# Altium schematic sheet Scheme_1.SchDoc
size A2; DrawnBy: Amrello
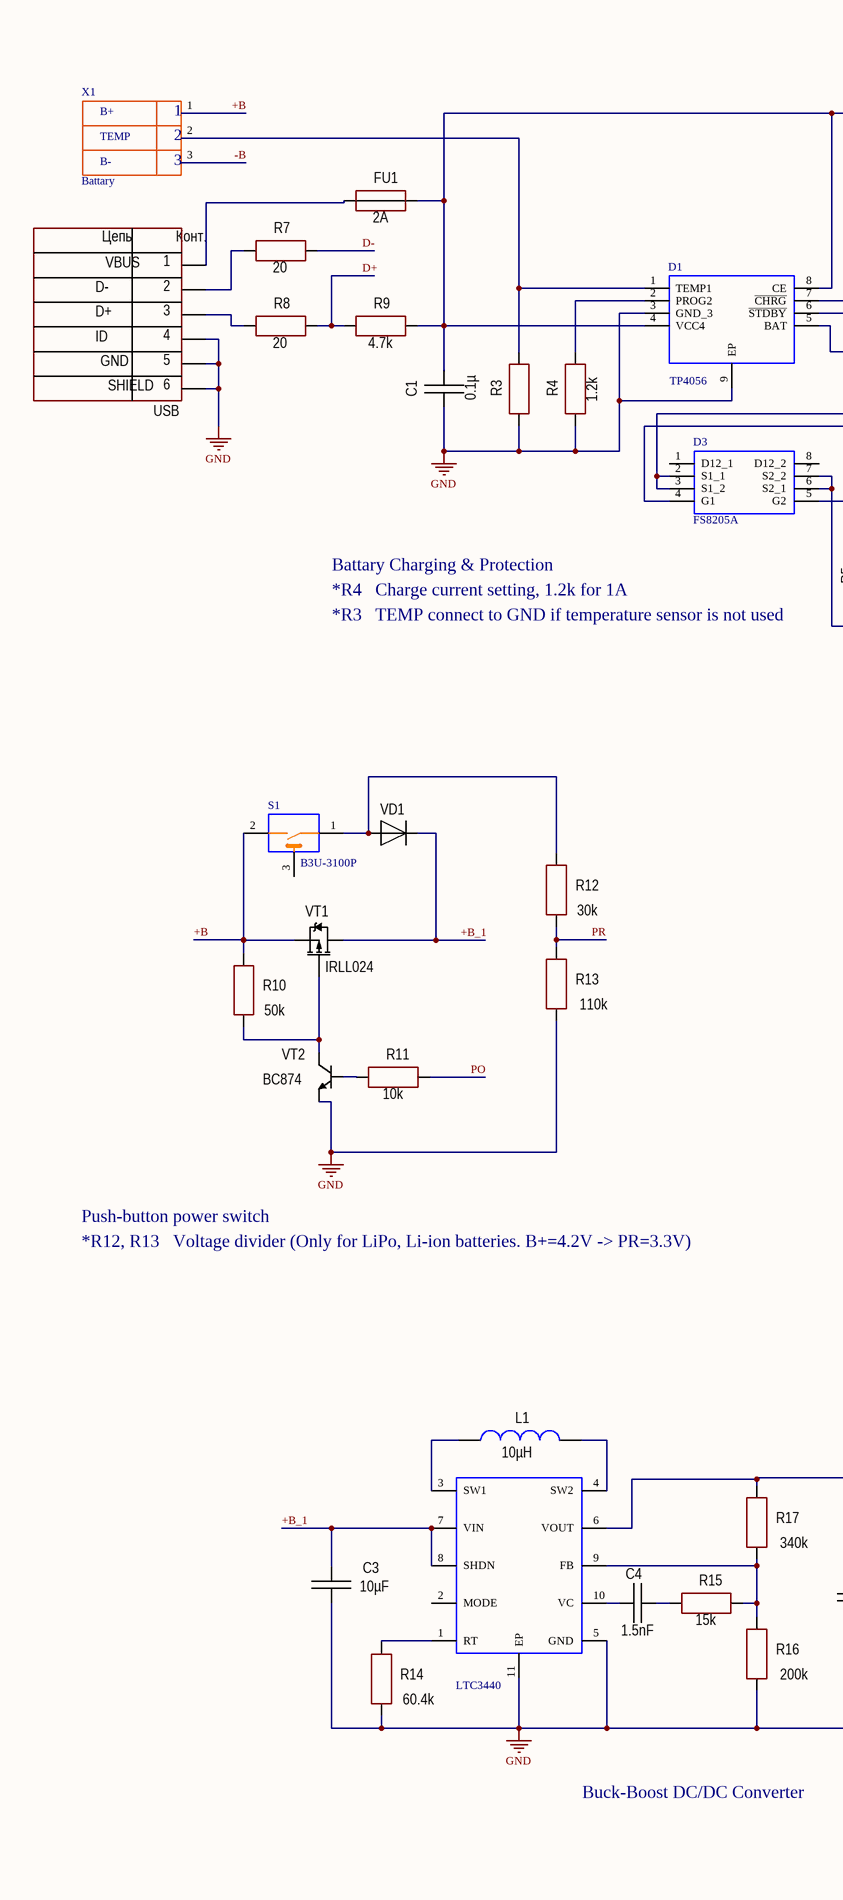
[diagram p0: Scheme_1.SchDoc, left]
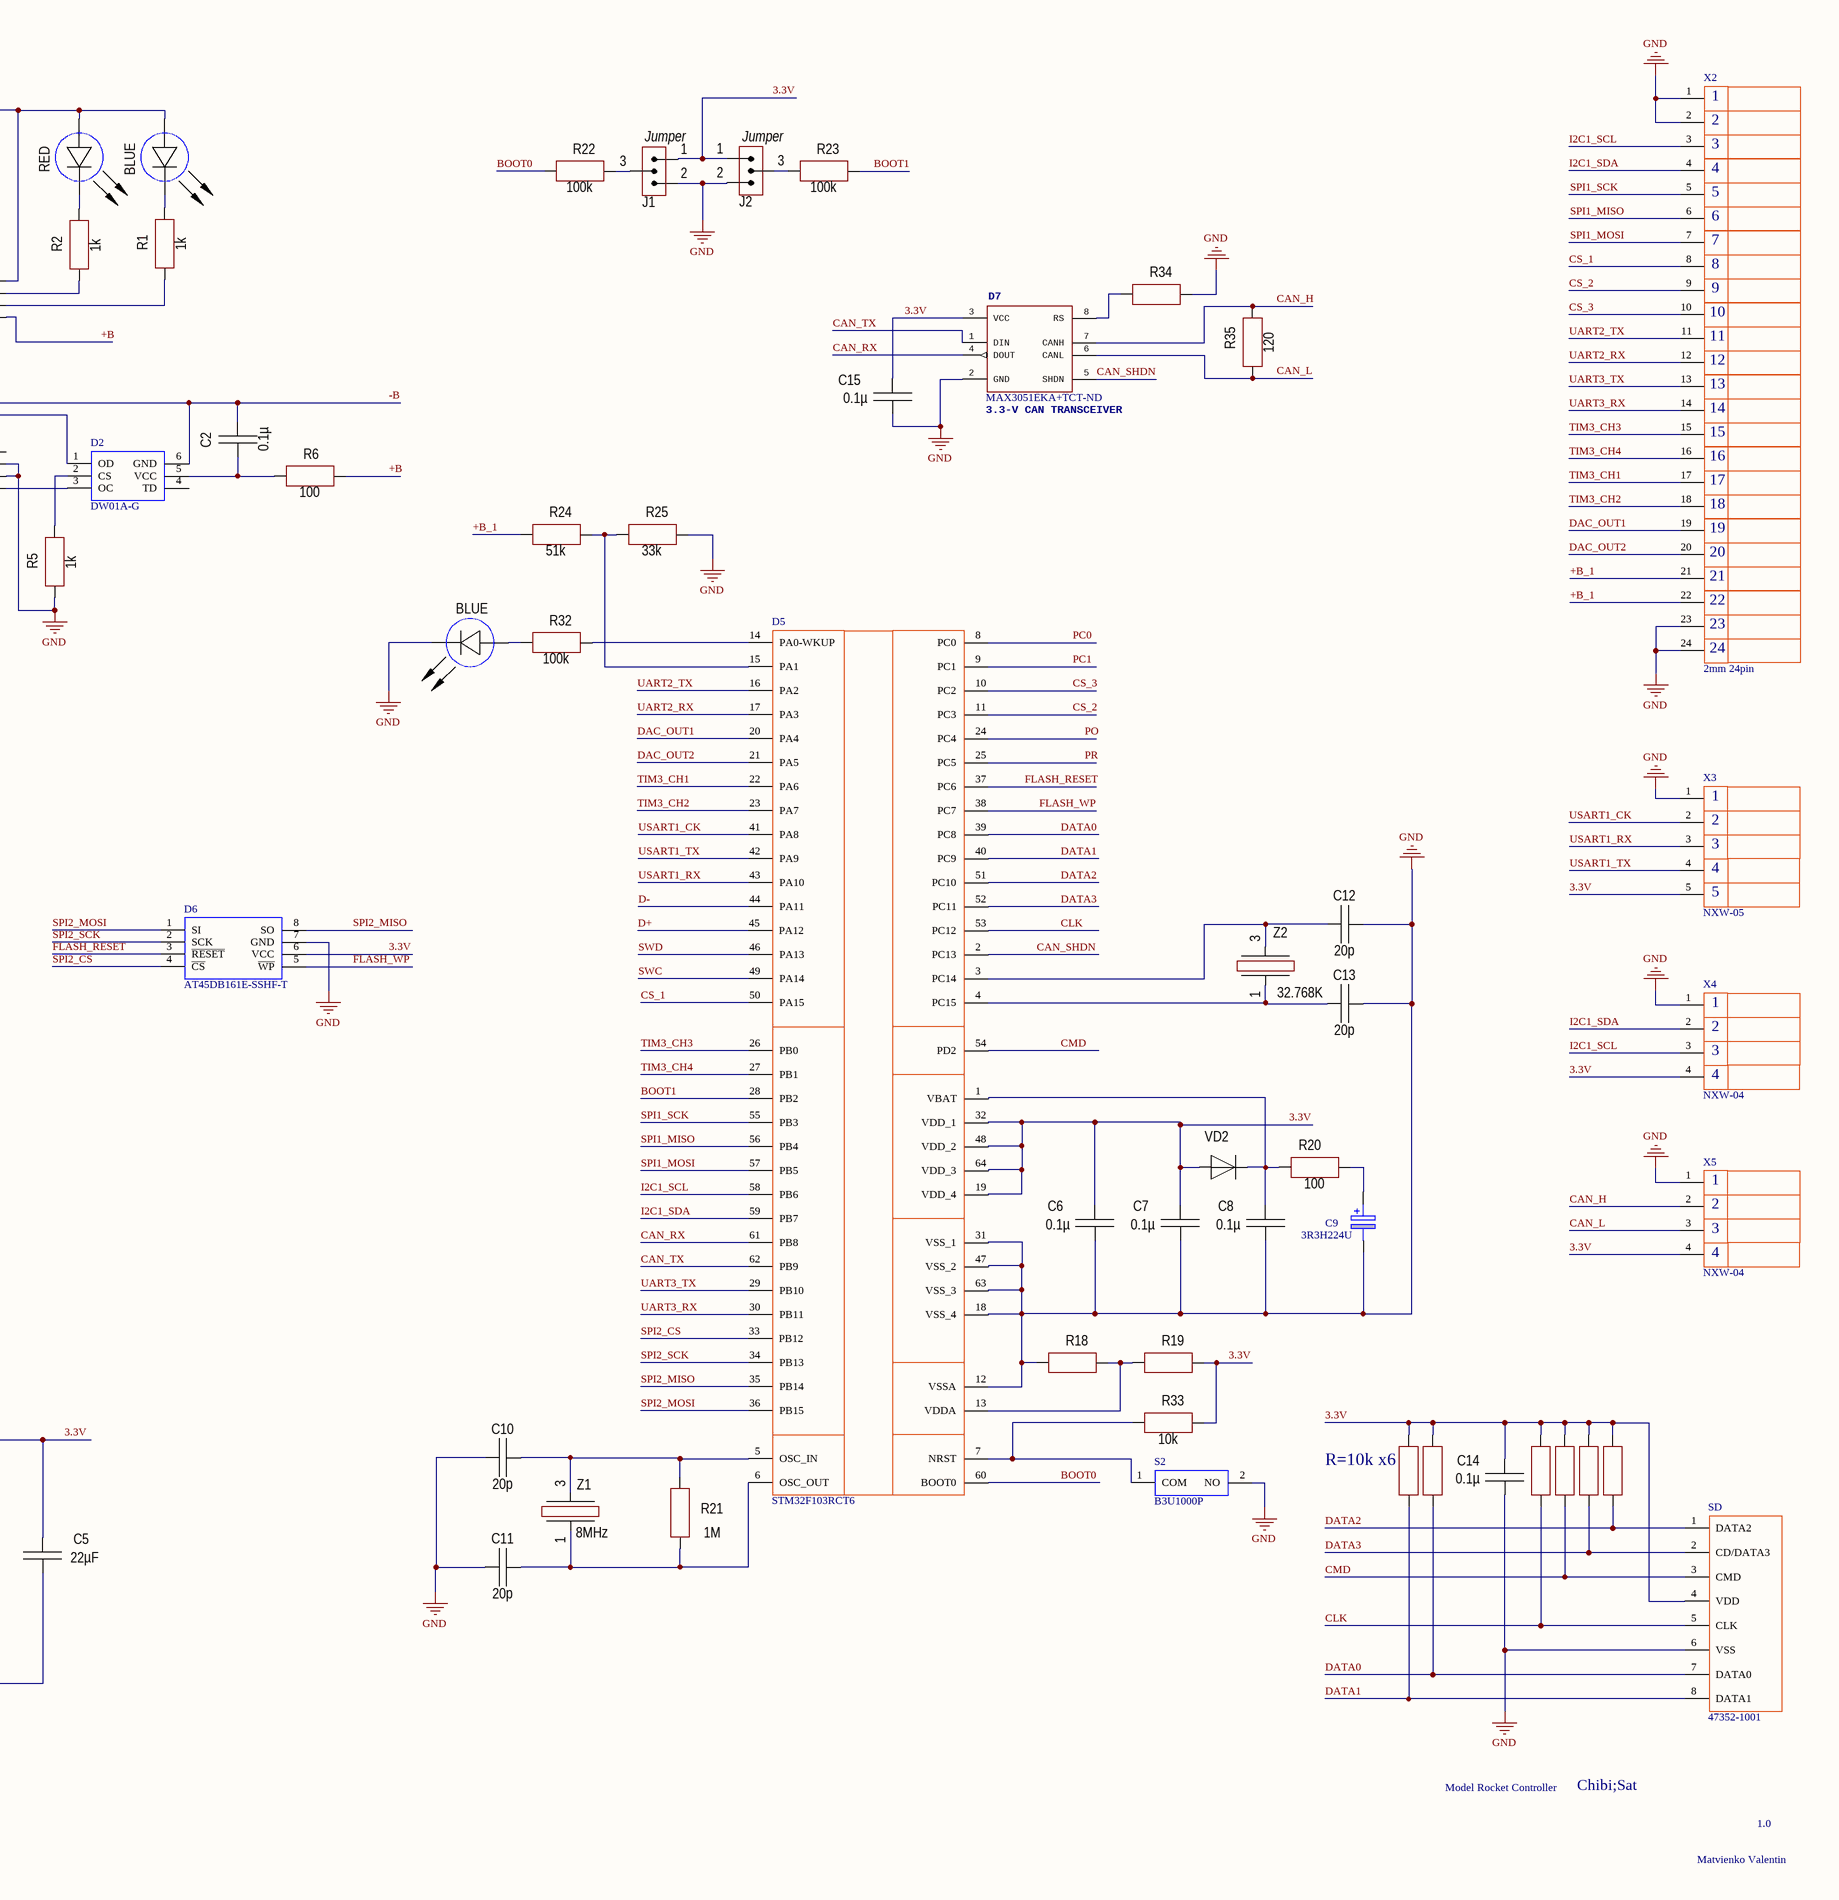
[diagram p1: Scheme_1.SchDoc, right]

## Parts
C1  0.1µ  [CH0805C]
C2  0.1µ  [CH0805C]
C3  10µF  [CH1210C]
C4  1.5nF  [CH0805C]
C5  22µF  [CH1210C]
C6  0.1µ  [CH0805C]
C7  0.1µ  [CH0805C]
C8  0.1µ  [CH0805C]
C9  3R3H224U  [DSK-414_HL]
C10  20p  [CH0805C]
C11  20p  [CH0805C]
C12  20p  [CH0805C]
C13  20p  [CH0805C]
C14  0.1µ  [CH0805C]
C15  0.1µ  [CH0805C]
D1  TP4056  [SOIC127P600X175-9N]
D2  DW01A-G  [SOT95P190X145-6N]
D3  FS8205A  [SOP65P640X120-8N]
D4  LTC3440  [SOP50P490X110-11N]
D5  STM32F103RCT6  [QFP50P1200X1200X160-64N]
D6  AT45DB161E-SSHF-T  [SOIC127P600X175-8N]
D7  3.3-V CAN TRANSCEIVER  Supplier Part Number 1: MAX3051EKA+TCT-ND  [SOT23-8]
FU1  2A  [CH1206F]
J1  Jumper  [CON: JUMPER]
J2  Jumper  [CON: JUMPER]
L1  10µH  [IND: CDRH4D28]
LED_B  BLUE  [CH0805LB]
LED_B?  BLUE  [CH0805LB]
LED_R  RED  [CH0805LR]
R1  1k  [CH0805R]
R2  1k  [CH0805R]
R3  (no value)  [CH0805R]
R4  1.2k  [CH0805R]
R5  1k  [CH0805R]
R6  100  [CH0805R]
R7  20  [CH0805R]
R8  20  [CH0805R]
R9  4.7k  [CH0805R]
R10  50k  [CH0805R]
R11  10k  [CH0805R]
R12  30k  [CH0805R]
R13  110k  [CH0805R]
R14  60.4k  [CH0805R]
R15  15k  [CH0805R]
R16  200k  [CH0805R]
R17  340k  [CH0805R]
R18  51k  [CH0805R]  (value not drawn)
R19  51k  [CH0805R]  (value not drawn)
R20  100  [CH0805R]
R21  1M  [CH0805R]
R22  100k  [CH0805R]
R23  100k  [CH0805R]
R24  51k  [CH0805R]
R25  33k  [CH0805R]
R26  10k  [CH0805R]  (value not drawn)
R27  10k  [CH0805R]  (value not drawn)
R28  10k  [CH0805R]  (value not drawn)
R29  10k  [CH0805R]  (value not drawn)
R30  10k  [CH0805R]  (value not drawn)
R31  10k  [CH0805R]  (value not drawn)
R32  100k  [CH0805R]
R33  10k  [CH0805R]
R34  10k  [CH0805R]  (value not drawn)
R35  120  [CH0805R]
S1  B3U-3100P  [B3U-3100P]
S2  B3U1000P  [B3U-1000P]
SD  47352-1001  [47352-1001]
USB  USB  [CON: USB-A micro]
VD1  *  [SOD80]  (value not drawn)
VD2  *  [SOD80]  (value not drawn)
VT1  IRLL024  [SOT223]
VT2  BC874  [SOT23_321]
X1  Battary  [PCBComponent_1]
X2  2mm 24pin  [PCBComponent_1]
X3  NXW-05  [PCBComponent_1]
X4  NXW-04  [PCBComponent_1]
X5  NXW-04  [PCBComponent_1]
Z1  8MHz  [OSC: 3215]
Z2  32.768K  [OSC: 3215]

## Nets
GND: C1.1 C3.1 C5.1 C6.1 C7.1 C8.1 C9.2(+) C10.2 C11.2 C12.1 C13.1 C14.1 C15.1 D1.3(GND_3) D1.9(EP) D3.6(S2_1) D3.7(S2_2) D4.5(GND) D4.11(EP) D5.12(VSSA) D5.18(VSS_4) D5.31(VSS_1) D5.47(VSS_2) D5.63(VSS_3) D6.7(GND) D7.2(GND) J1.2(IN) J2.2(IN) LED_B?.2(C) R3.1 R4.1 R5.1 R13.1 R14.1 R16.1 R18.1 R25.2 R34.2 S2.2(NO) SD.6(VSS) USB.0 USB.4 USB.5 VT2.3(E) X2.1 X2.2 X2.23 X2.24 X3.1 X4.1 X5.1
3.3V: C5.2 C6.2 C7.2 C14.2 C15.2 D4.6(VOUT) D5.19(VDD_4) D5.32(VDD_1) D5.48(VDD_2) D5.64(VDD_3) D6.6(VCC) D7.3(VCC) J1.1(IN) J2.1(IN) R17.2 R19.2 R26.2 R27.2 R28.2 R29.2 R30.2 R31.2 R33.2 SD.4(VDD) VD2.1 X3.5 X4.4 X5.4
+B: D1.5(BAT) R6.2 R10.2 S1.2 VT1.3(S) X1.1
+B_1: C3.2 D4.7(VIN) D4.8(SHDN) R24.1 VD1.2 VT1.2(D) X2.21 X2.22
-B: C2.2 D2.6(GND) D3.2(S1_1) D3.3(S1_2) X1.3
BOOT0: D5.60(BOOT0) R22.1
BOOT1: D5.28(PB2) R23.2
CAN_H: D7.7(CANH) R35.2 X5.2
CAN_L: D7.6(CANL) R35.1 X5.3
CAN_RX: D5.61(PB8) D7.4(DOUT)
CAN_SHDN: D5.2(PC13) D7.5(SHDN)
CAN_TX: D5.62(PB9) D7.1(DIN)
CLK: D5.53(PC12) R29.1 SD.5(CLK)
CMD: D5.54(PD2) R28.1 SD.3(CMD)
CS_1: D5.50(PA15) X2.8
CS_2: D5.11(PC3) X2.9
CS_3: D5.10(PC2) X2.10
D+: D5.45(PA12) R8.2 R9.1
D-: D5.44(PA11) R7.2
DAC_OUT1: D5.20(PA4) X2.19
DAC_OUT2: D5.21(PA5) X2.20
DATA0: D5.39(PC8) R30.1 SD.7(DATA0)
DATA1: D5.40(PC9) R31.1 SD.8(DATA1)
DATA2: D5.51(PC10) R26.1 SD.1(DATA2)
DATA3: D5.52(PC11) R27.1 SD.2(CD/DATA3)
FLASH_RESET: D5.37(PC6) D6.3(~{RESET})
FLASH_WP: D5.38(PC7) D6.5(~{WP})
I2C1_SCL: D5.58(PB6) X2.3 X4.3
I2C1_SDA: D5.59(PB7) X2.4 X4.2
PC0: D5.8(PC0)
PC1: D5.9(PC1)
PO: D5.24(PC4) R11.2
PR: D5.25(PC5) R12.1 R13.2
SPI1_MISO: D5.56(PB4) X2.6
SPI1_MOSI: D5.57(PB5) X2.7
SPI1_SCK: D5.55(PB3) X2.5
SPI2_CS: D5.33(PB12) D6.4(~{CS})
SPI2_MISO: D5.35(PB14) D6.8(SO)
SPI2_MOSI: D5.36(PB15) D6.1(SI)
SPI2_SCK: D5.34(PB13) D6.2(SCK)
SWC: D5.49(PA14)
SWD: D5.46(PA13)
TIM3_CH1: D5.22(PA6) X2.17
TIM3_CH2: D5.23(PA7) X2.18
TIM3_CH3: D5.26(PB0) X2.15
TIM3_CH4: D5.27(PB1) X2.16
UART2_RX: D5.17(PA3) X2.12
UART2_TX: D5.16(PA2) X2.11
UART3_RX: D5.30(PB11) X2.14
UART3_TX: D5.29(PB10) X2.13
USART1_CK: D5.41(PA8) X3.2
USART1_RX: D5.43(PA10) X3.3
USART1_TX: D5.42(PA9) X3.4
NetC1_2: C1.2 D1.4(VCC4) D1.8(CE) FU1.2 LED_B.1(A) LED_R.1(A) R9.2
NetC2_1: C2.1 D2.5(VCC) R6.1
NetC4_1: C4.1 D4.10(VC)
NetC4_2: C4.2 R15.1
NetC8_2: C8.2 D5.1(VBAT) R20.2 VD2.2
NetC9_1: C9.1(-) R20.1
NetC10_1: C10.1 D5.5(OSC_IN) R21.2 Z1.3
NetC11_1: C11.1 D5.6(OSC_OUT) R21.1 Z1.1
NetC12_2: C12.2 D5.3(PC14) Z2.3
NetC13_2: C13.2 D5.4(PC15) Z2.1
NetD1_1: D1.1(TEMP1) R3.2 X1.2
NetD1_2: D1.2(PROG2) R4.2
NetD1_6: D1.6(~{STDBY}) R1.1
NetD1_7: D1.7(~{CHRG}) R2.1
NetD2_1: D2.1(OD) D3.4(G1)
NetD2_2: D2.2(CS) R5.2
NetD2_3: D2.3(OC) D3.5(G2)
NetD4_1: D4.1(RT) R14.2
NetD4_3: D4.3(SW1) L1.2
NetD4_4: D4.4(SW2) L1.1
NetD4_9: D4.9(FB) R15.2 R16.2 R17.1
NetD5_7: D5.7(NRST) R33.1 S2.1(COM)
NetD5_13: D5.13(VDDA) R18.2 R19.1
NetD5_14: D5.14(PA0-WKUP) R32.2
NetD5_15: D5.15(PA1) R24.2 R25.1
NetD7_8: D7.8(RS) R34.1
NetFU1_1: FU1.1 USB.1
NetJ1_3: J1.3(IN) R22.2
NetJ2_3: J2.3(IN) R23.1
NetLED_B?_1: LED_B?.1(A) R32.1
NetLED_B_2: LED_B.2(C) R1.2
NetLED_R_2: LED_R.2(C) R2.2
NetR7_1: R7.1 USB.2
NetR8_1: R8.1 USB.3
NetR10_1: R10.1 VT1.1(G) VT2.2(C)
NetR11_1: R11.1 VT2.1(B)
NetR12_2: R12.2 S1.1 VD1.1

Not connected (* = marked no-connect by the designer): D2 4(TD); D3 1(D12_1) 8(D12_2); D4 2(MODE); S1 3

## Notes on the sheet
- B+
- TEMP
- B-
- Battary Charging & Protection
- *R4   Charge current setting, 1.2k for 1A
- (near R5) *R3   TEMP connect to GND if temperature sensor is not used
- Push-button power switch
- *R12, R13   Voltage divider (Only for LiPo, Li-ion batteries. B+=4.2V -> PR=3.3V)
- (near R31) R=10k x6
- Buck-Boost DC/DC Converter
- Model Rocket Controller
- Chibi;Sat
- Matvienko Valentin
- 1.0
- (in symbol USB-AM) Цепь; Конт.; VBUS; D-; D+; ID; GND; SHIELD; 6

## Library data of the parts
C1 C3-C8 C10-C15 = Capacitor: Manufacturer: *; Model: *; HelpURL: *; ComponentKind: *
  C1 C6-C8 C14 C15: Value: 0.1µ
  C3: Value: 10µF
  C4: Value: 1.5nF
  C5: Value: 22µF
  C10-C13: Value: 20p
C2 = Capacitor: Value: 0.1u; Manufacturer: *; Model: *; HelpURL: *; ComponentKind: *
C9 = DSK-3R3H224U-HL: Supercapacitors / Ultracapacitors 3.3V .22F 6.8x2.1; Manufacturer_Name: Elna; Manufacturer_Part_Number: DSK-3R3H224U-HL; RS Part Number: *; RS Price/Stock: *; Mouser Part Number: 555-DSK3R3H224U-HL; Mouser Price/Stock: https://www.mouser.com/Search/Refine.aspx?Keyword=555-DSK3R3H224U-HL; Datasheet Link: https://componentsearchengine.com/Datasheets/1/DSK-3R3H224U-HL.pdf
D1 = TP4056: 1A Standalone Linear Li-lon Battery Charger, SOP-8; Manufacturer_Name: NanJing Top Power; Geometry.Height: 1.75mm; Manufacturer_Part_Number: TP4056; RS Part Number: *; RS Price/Stock: *; Mouser Part Number: *; Mouser Price/Stock: *; Datasheet Link: https://dlnmh9ip6v2uc.cloudfront.net/datasheets/Prototyping/TP4056.pdf
D2 = DW01A-G: one cell lithium-ion/polymer battery protection IC; Manufacturer_Name: SII Semiconductor; Geometry.Height: 1.45mm; Manufacturer_Part_Number: DW01A-G; RS Part Number: *; RS Price/Stock: *; Mouser Part Number: *; Mouser Price/Stock: *; Datasheet Link: http://www.ic-fortune.com/upload/Download/DW01x-DS-17_EN.pdf
D3 = FS8205A: dual n-channel enhancement mode power MOFSET; Manufacturer_Name: SII Semiconductor; Geometry.Height: 1.2mm; Manufacturer_Part_Number: FS8205A; RS Part Number: *; RS Price/Stock: *; Mouser Part Number: *; Mouser Price/Stock: *; Datasheet Link: http://www.ic-fortune.com/upload/Download/FS8205A-DS-12_EN.pdf
D4 = TPS40210DGQR: Buck-Boost DC/DC Converter; Geometry.Height: 1.1mm
D5 = STM32F103RCT6: STM32F103RCT6, 32 bit ARM Cortex M3 Microcontroller 72MHz 256 kB Flash, 48 kB RAM, USB CAN I2C 64-Pin LQFP; Manufacturer_Name: STMicroelectronics; Allied_Number: 70391008; Geometry.Height: 1.6mm; Manufacturer_Part_Number: STM32F103RCT6; RS Part Number: 1459607; RS Price/Stock: http://uk.rs-online.com/web/p/products/1459607; Allied Price/Stock: http://www.alliedelec.com/stmicroelectronics-stm32f103rct6/70391008/; Mouser Part Number: 511-STM32F103RCT6; Mouser Price/Stock: https://www.mouser.com/Search/Refine.aspx?Keyword=511-STM32F103RCT6; Datasheet Link: http://www.st.com/st-web-ui/static/active/en/resource/technical/document/datasheet/CD00191185.pdf
D6 = AT45DB161E-SSHF-T: NOR Flash 16M 2.3-3.6V 85Mhz Data Flash; Manufacturer_Name: Adesto Technologies; Geometry.Height: 1.75mm; Manufacturer_Part_Number: AT45DB161E-SSHF-T; RS Part Number: *; RS Price/Stock: *; Mouser Part Number: 556-AT45DB161E-SSHFT; Mouser Price/Stock: https://www.mouser.com/Search/Refine.aspx?Keyword=556-AT45DB161E-SSHFT; Datasheet Link: https://componentsearchengine.com/Datasheets/1/AT45DB161E-SSHF-T.pdf
D7 = MAX3051MAX3051EKA: IC TXRX CAN 1MBPS SOT23-8; 3DR_PARTNO: ECM0831; PARTNO: MAX3051EKA+T; Supplier 1: Digi-Key; Value: CAN
FU1 = Fuse: Manufacturer: *; Model: *; HelpURL: *; ComponentKind: *; Value: 2A
L1 = Inductor: Manufacturer: *; Model: *; HelpURL: *; ComponentKind: *; Value: *
LED_B LED_B? LED_R = LED: Manufacturer: *; Model: *; HelpURL: *; ComponentKind: *; Value: *
R1 R2 R4 R5 R15 R16 R18-R20 R22-R24 R32 = Resistor: Manufacturer: *; Model: *; HelpURL: *; ComponentKind: *
  R1 R2 R5: Value: 1k
  R4: Value: 1.2k
  R15: Value: 15k
  R16: Value: 200k
  R18 R19 R24: Value: 51k
  R20: Value: 100
  R22 R23 R32: Value: 100k
R3 R6-R14 R25 = Resistor: Value: 1k; Manufacturer: *; Model: *; HelpURL: *; ComponentKind: *
R17 R21 R26-R31 = Resistor: Value: 200k; Manufacturer: *; Model: *; HelpURL: *; ComponentKind: *
R33-R35 = Resistor: Value: 51k; Manufacturer: *; Model: *; HelpURL: *; ComponentKind: *
S1 = B3U-3100P: Switch Tact,ultra small,side act,grnd tm Button Tactile Switch, SPST-NO 0.05 A@ 12 V dc 0.7mm; Manufacturer_Name: Omron Electronics; Mouser Part Number: 653-B3U-3100P; Manufacturer_Part_Number: B3U-3100P; Datasheet Link: http://www.mouser.com/datasheet/2/307/en-b3u-3615.pdf
S2 = B3U1000P: IP40 Tactile Tactile Switch, SPST-NO 50 mA@ 12 V dc; Manufacturer_Name: Omron Electronics; Manufacturer_Part_Number: B3U1000P; Mouser Part Number: *; Mouser Price/Stock: *; RS Part Number: 0419867P; RS Price/Stock: http://uk.rs-online.com/web/p/products/0419867P; Datasheet Link: https://omronfs.omron.com/en_US/ecb/products/pdf/en-b3u.pdf
SD = 47352-1001: Molex 47388 Series 8 Way Right Angle Micro SD Memory Card Connector with Solder Termination; Allied_Number: 70374601; Manufacturer_Name: Molex; Manufacturer_Part_Number: 47352-1001; RS Part Number: 7206016P; RS Price/Stock: http://uk.rs-online.com/web/p/products/7206016P; Allied Price/Stock: https://www.alliedelec.com/molex-incorporated-47352-1001/70374601/; Mouser Part Number: 538-47352-1001; Mouser Price/Stock: https://www.mouser.com/Search/Refine.aspx?Keyword=538-47352-1001; Datasheet Link: http://www.molex.com/pdm_docs/sd/473521001_sd.pdf
USB = USB-AM: Manufacturer: Hirose; Model: ZX62-B-5PA; HelpURL: https://lcsc.com/product-detail/USB-Connectors_HRS_ZX62-B-5PA-33_ZX62-B-5PA-33_C132561.html; ComponentKind: type micro A
VD1 VD2 = Diod: ComponentKind: *; Manufacturer: *; Model: *; HelpURL: *
VT1 = P-chanel: Mosfet; Model: IRLL024; Manufacturer: *; ComponentKind: *; HelpURL: *
VT2 = NPN: Bipolar; Model: BC874; Manufacturer: *; ComponentKind: *; HelpURL: *
X1-X5 = Component_1: Model: *; Manufacture: *
Z1 Z2 = Oscillator: Manufacturer: *; Model: *; HelpURL: *; ComponentKind: *
  Z1: Value: 8MHz
  Z2: Value: 32.768K